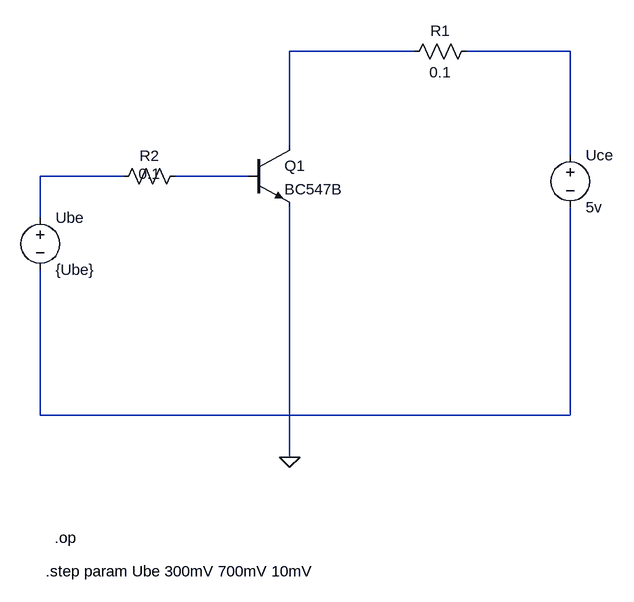
[diagram p0: schematic BJT.asc]
BJT.asc, the LTspice schematic file:
Version 4
SHEET 1 880 788
WIRE 432 -48 240 -48
WIRE 672 -48 512 -48
WIRE 240 96 240 -48
WIRE 672 112 672 -48
WIRE -16 144 -144 144
WIRE 176 144 64 144
WIRE -144 208 -144 144
WIRE -144 512 -144 288
WIRE 672 512 672 192
WIRE 672 512 -144 512
WIRE 240 576 240 192
FLAG 240 576 0
SYMBOL npn 176 96 R0
SYMATTR InstName Q1
SYMATTR Value BC547B
SYMBOL LTspice_EuroComponents\\voltage -144 192 R0
SYMATTR InstName Ube
SYMATTR Value {Ube}
SYMBOL LTspice_EuroComponents\\voltage 672 96 R0
SYMATTR InstName Uce
SYMATTR Value 5v
SYMBOL res 528 -64 R90
WINDOW 0 0 56 VBottom 2
WINDOW 3 32 56 VTop 2
SYMATTR InstName R1
SYMATTR Value 0.1
SYMBOL res 80 128 R90
WINDOW 0 0 56 VBottom 2
WINDOW 3 28 56 VBottom 2
SYMATTR InstName R2
SYMATTR Value 0.1
TEXT -136 752 Left 2 !.step param Ube 300mV 700mV 10mV
TEXT -122 700 Left 2 !.op

The netlist it stands for:
* BJT.asc
Q1 N001 N004 0 0 BC547B
V§Ube N003 N005 {Ube}
V§Uce N002 N005 5v
R1 N002 N001 0.1
R2 N004 N003 0.1
.model NPN NPN
.model PNP PNP
.lib standard.bjt
.step param Ube 300mV 700mV 10mV
.op
.backanno
.end